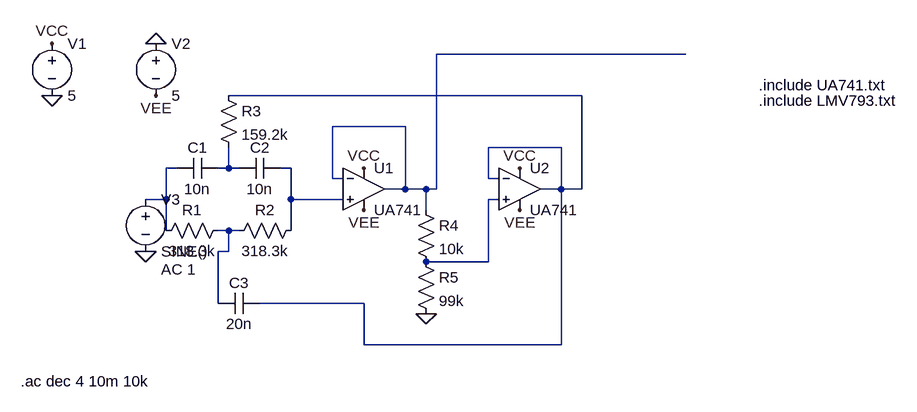
[diagram p0: schematic Bandstop.asc]
Bandstop.asc, the LTspice schematic file:
Version 4
SHEET 1 884 680
WIRE 528 -224 144 -224
WIRE 368 -160 -176 -160
WIRE 96 -112 -16 -112
WIRE 336 -80 224 -80
WIRE -256 -48 -272 -48
WIRE -176 -48 -176 -80
WIRE -176 -48 -192 -48
WIRE -160 -48 -176 -48
WIRE -80 -48 -96 -48
WIRE -16 -32 -16 -112
WIRE 0 -32 -16 -32
WIRE 224 -32 224 -80
WIRE 240 -32 224 -32
WIRE 96 -16 96 -112
WIRE 96 -16 64 -16
WIRE 128 -16 96 -16
WIRE 144 -16 144 -224
WIRE 144 -16 128 -16
WIRE 336 -16 336 -80
WIRE 336 -16 304 -16
WIRE 368 -16 368 -160
WIRE 368 -16 336 -16
WIRE -272 0 -272 -48
WIRE -272 0 -304 0
WIRE -80 0 -80 -48
WIRE 0 0 -80 0
WIRE 240 0 224 0
WIRE 128 16 128 -16
WIRE -272 48 -272 0
WIRE -176 48 -192 48
WIRE -160 48 -176 48
WIRE -80 48 -80 0
WIRE -176 80 -176 48
WIRE -176 80 -192 80
WIRE 224 96 224 0
WIRE 224 96 128 96
WIRE -192 160 -192 80
WIRE 32 160 -128 160
WIRE 32 224 32 160
WIRE 336 224 336 -16
WIRE 336 224 32 224
FLAG -448 -240 VCC
FLAG -288 -160 VEE
FLAG -448 -160 0
FLAG -288 -240 0
FLAG 32 -48 VCC
FLAG 32 16 VEE
FLAG -304 80 0
FLAG 128 176 0
FLAG 272 16 VEE
FLAG 272 -48 VCC
SYMBOL voltage -448 -256 R0
WINDOW 123 0 0 Left 0
WINDOW 39 0 0 Left 0
SYMATTR InstName V1
SYMATTR Value 5
SYMBOL voltage -288 -256 R0
WINDOW 123 0 0 Left 0
WINDOW 39 0 0 Left 0
SYMATTR InstName V2
SYMATTR Value 5
SYMBOL Opamps\\opamp2 32 -80 R0
SYMATTR InstName U1
SYMATTR Value UA741
SYMBOL cap -192 -64 R90
WINDOW 0 0 32 VBottom 2
WINDOW 3 32 32 VTop 2
SYMATTR InstName C1
SYMATTR Value 10n
SYMBOL cap -96 -64 R90
WINDOW 0 0 32 VBottom 2
WINDOW 3 32 32 VTop 2
SYMATTR InstName C2
SYMATTR Value 10n
SYMBOL cap -128 144 R90
WINDOW 0 0 32 VBottom 2
WINDOW 3 32 32 VTop 2
SYMATTR InstName C3
SYMATTR Value 20n
SYMBOL res -176 32 R90
WINDOW 0 0 56 VBottom 2
WINDOW 3 32 56 VTop 2
SYMATTR InstName R1
SYMATTR Value 318.3k
SYMBOL res -64 32 R90
WINDOW 0 0 56 VBottom 2
WINDOW 3 32 56 VTop 2
SYMATTR InstName R2
SYMATTR Value 318.3k
SYMBOL res -192 -176 R0
SYMATTR InstName R3
SYMATTR Value 159.2k
SYMBOL voltage -304 -16 R0
WINDOW 123 24 124 Left 2
WINDOW 39 0 0 Left 0
SYMATTR Value2 AC 1
SYMATTR InstName V3
SYMATTR Value SINE()
SYMBOL res 112 0 R0
SYMATTR InstName R4
SYMATTR Value 10k
SYMBOL res 112 80 R0
SYMATTR InstName R5
SYMATTR Value 99k
SYMBOL Opamps\\opamp2 272 -80 R0
SYMATTR InstName U2
SYMATTR Value UA741
TEXT 640 -176 Left 2 !.include UA741.txt
TEXT 640 -152 Left 2 !.include LMV793.txt
TEXT -496 280 Left 2 !.ac dec 4 10m 10k

The netlist it stands for:
* Bandstop.asc
V1 VCC 0 5
V2 0 VEE 5
XU1 N005 N001 VCC VEE N001 UA741  ; pins In+ In- V+ V- OUT
C1 N004 N003 10n
C2 N005 N004 10n
C3 N002 N007 20n
R1 N007 N003 318.3k
R2 N005 N007 318.3k
R3 N002 N004 159.2k
V3 N003 0 SINE() AC 1
R4 N001 N006 10k
R5 N006 0 99k
XU2 N006 N002 VCC VEE N002 UA741  ; pins In+ In- V+ V- OUT
.include UA741.txt
.include LMV793.txt
.ac dec 4 10m 10k
.backanno
.end